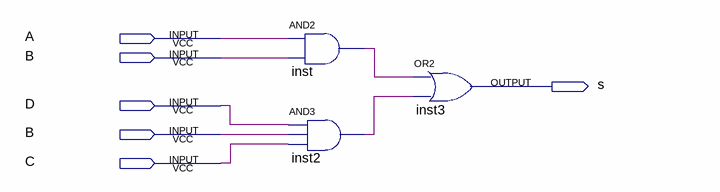
[diagram p0: schematic sheet]
// Quartus schematic QUEST_1_3.bdf as structural Verilog: 3 symbols, 6 pins
module QUEST_1_3 (
  input  A,
  input  B,
  input  D,
  input  C,
  output s
);

  wire inst2_out, inst_out;

  and inst (inst_out, A, B);
  and inst2 (inst2_out, D, B, C);
  or inst3 (s, inst_out, inst2_out);
endmodule
